# EAGLE schematic adafruit flora mainboard (EAGLE 6.5.0)
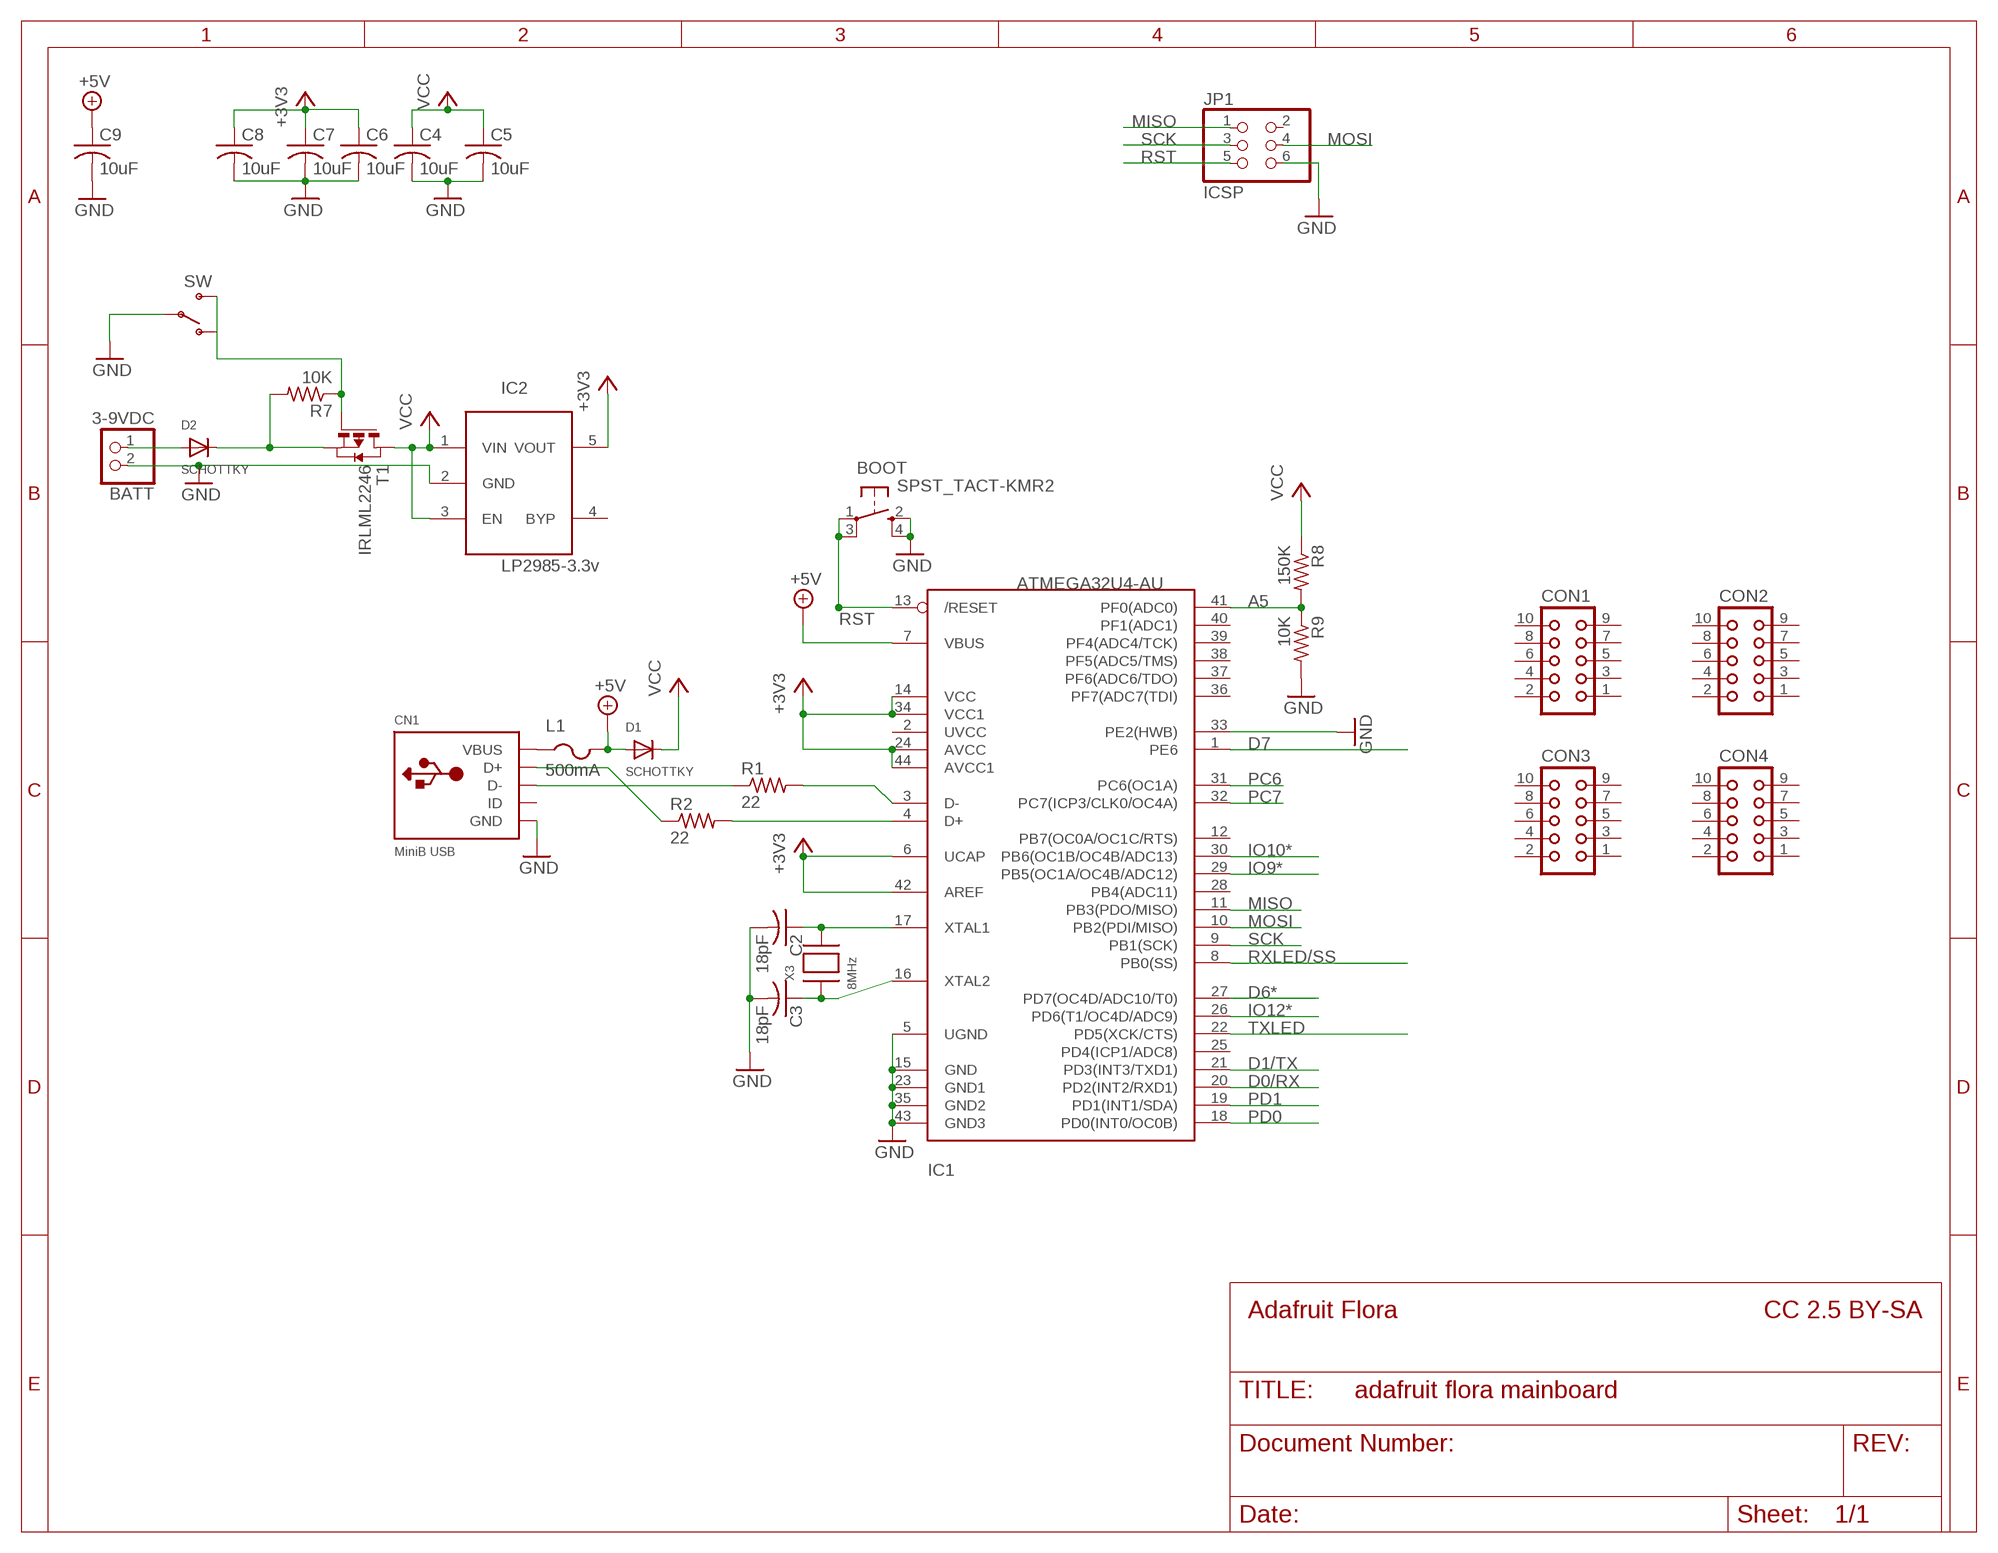
[diagram p0: schematic, sheet 1]

## Parts
BATT  3-9VDC  JST_2PIN-SMT-RA  [JST-PH-2-SMT-RA]
BOOT  SPST_TACT-KMR2  [KMR2]
C2  18pF  C-USC0805K  [C0805K]
C3  18pF  C-USC0805K  [C0805K]
C4  10uF  C-USC0805K  [C0805K]
C5  10uF  C-USC0805K  [C0805K]
C6  10uF  C-USC0805K  [C0805K]
C7  10uF  C-USC0805K  [C0805K]
C8  10uF  C-USC0805K  [C0805K]
C9  10uF  C-USC0805K  [C0805K]
CN1  MiniB USB  USBMINIBLARGE  [USB-MINIB_LARGER]
CON1  CON10  [CON10]
CON2  CON10  [CON10]
CON3  CON10  [CON10]
CON4  CON10  [CON10]
D1  SCHOTTKY  DIODESOD-123  [SOD-123]
D2  SCHOTTKY  DIODESOD-123  [SOD-123]
IC1  ATMEGA32U4-AU  [TQFP44]
IC2  LP2985-3.3v  LP298XS  [SOT23-5L]
JP1  ICSP  PINHD-2X3  [2X03]
L1  500mA  PTCFUSE-1206  [R1206]
R1  22  R-US_R0805  [R0805]
R2  22  R-US_R0805  [R0805]
R7  10K  R-US_R0805  [R0805]
R8  150K  R-US_R0805  [R0805]
R9  10K  R-US_R0805  [R0805]
SW  SPDT  SWITCH-SPSTSMD2  [SWITCH-SPDT-SMD]
T1  IRLML2246  PMOSSOT23  [SOT-23]
X3  8MHz  XTALNX5032  [NX5032]

## Nets
+3V3: C6.1 C7.1 C8.1 IC1.6(UCAP) IC1.14(VCC) IC1.24(AVCC) IC1.34(VCC1) IC1.42(AREF) IC1.44(AVCC1) IC2.5(VOUT)
+5V: C9.1 D1.A IC1.7(VBUS) L1.2
A5: IC1.41(PF0(ADC0)) R8.2 R9.1
D0/RX: IC1.20(PD2(INT2/RXD1))
D1/TX: IC1.21(PD3(INT3/TXD1))
D6*: IC1.27(PD7(OC4D/ADC10/T0))
D7: IC1.1(PE6)
GND: BATT.2 BOOT.2(S) BOOT.4(S1) C2.2 C3.2 C4.2 C5.2 C6.2 C7.2 C8.2 C9.2 CN1.GND IC1.5(UGND) IC1.15(GND) IC1.23(GND1) IC1.33(PE2(HWB)) IC1.35(GND2) IC1.43(GND3) IC2.2(GND) JP1.6 R9.2 SW.2(P)
IO9*: IC1.29(PB5(OC1A/OC4B/ADC12))
IO10*: IC1.30(PB6(OC1B/OC4B/ADC13))
IO12*: IC1.26(PD6(T1/OC4D/ADC9))
MISO: IC1.11(PB3(PDO/MISO)) JP1.1
MOSI: IC1.10(PB2(PDI/MISO)) JP1.4
N$2: CN1.D+ R2.1
N$3: IC1.3(D-) R1.2
N$4: IC1.4(D+) R2.2
N$5: CN1.D- R1.1
N$6: D2.C R7.2 T1.2(S)
N$7: BATT.1 D2.A
N$8: C2.1 IC1.17(XTAL1) X3.P$2
N$9: C3.1 IC1.16(XTAL2) X3.P$1
N$13: R7.1 SW.3(S) T1.3(G)
PC6: IC1.31(PC6(OC1A))
PC7: IC1.32(PC7(ICP3/CLK0/OC4A))
PD0: IC1.18(PD0(INT0/OC0B))
PD1: IC1.19(PD1(INT1/SDA))
RST: BOOT.1(P) BOOT.3(P1) IC1.13(/RESET) JP1.5
RXLED/SS: IC1.8(PB0(SS))
SCK: IC1.9(PB1(SCK)) JP1.3
TXLED: IC1.22(PD5(XCK/CTS))
VBUS: CN1.VBUS L1.1
VCC: C4.1 C5.1 D1.C IC2.1(VIN) IC2.3(EN) R8.1 T1.1(D)
Unconnected: CN1.ID CON1.1 CON1.2 CON1.3 CON1.4 CON1.5 CON1.6 CON1.7 CON1.8 CON1.9 CON1.10 CON2.1 CON2.2 CON2.3 CON2.4 CON2.5 CON2.6 CON2.7 CON2.8 CON2.9 CON2.10 CON3.1 CON3.2 CON3.3 CON3.4 CON3.5 CON3.6 CON3.7 CON3.8 CON3.9 CON3.10 CON4.1 CON4.2 CON4.3 CON4.4 CON4.5 CON4.6 CON4.7 CON4.8 CON4.9 CON4.10 IC1.2(UVCC) IC1.12(PB7(OC0A/OC1C/RTS)) IC1.25(PD4(ICP1/ADC8)) IC1.28(PB4(ADC11)) IC1.36(PF7(ADC7(TDI)) IC1.37(PF6(ADC6/TDO)) IC1.38(PF5(ADC5/TMS)) IC1.39(PF4(ADC4/TCK)) IC1.40(PF1(ADC1)) IC2.4(BYP) JP1.2 SW.1(O)

## Notes on the sheet
- Adafruit Flora | CC 2.5 BY-SA

## Library data of the parts
BATT = adafruit:JST_2PIN: JST 2-Pin Connectors of various flavors SMT-RA (S2B-PH-SM4) 4UConnector #17311 SMT (B2B-PH-SM4) THM-RA (S2B-PH) THM (B2B-PH)
BOOT = adafruit:SPST_TACT: SMT 6mm switch, EVQQ2 series http://www.ladyada.net/library/eagle
C2-C9 = adafruit:C-US: CAPACITOR, American symbol
CN1 = microbuilder:USB: USB Connectors USBMINIB - Surface Mount Female Mini-B USB Connector 4UConnector: 06564
CON1-CON4 = con-harting:CON10: CONNECTOR; OC_FARNELL: unknown; OC_NEWARK: unknown
D1 D2 = adafruit:DIODE: Diode SMADIODE - SMA Surface Mount Package 20V 1A Schottky Diode Digikey: 641-1014-6-ND DO-1N4148 - Through Hole Small Current Diode SOD-123 20V 1 A (.5mV Vf) Schottky Diode - Digikey: MBRX120TPMSCT-ND SOD-323 10V 570mA (.38mV Vf, 3ns) Schottky Diode - Digikey: ZLLS410CT-ND SOD-523 30V 30mA Schottky Diode (RB751S-40TE61) - Digikey: RB751S-40TE61CT-ND SOT23-R/W - SOT23 Package (R = Solder Paste/Reflow Ovens, W = Hand-Soldering) BAT54Film 40V 300mA - Digikey: 497-7162-1-ND
IC1 = adaprog:ATMEGA32U4
IC2 = adafruit:LP298X
JP1 = pinhead:PINHD-2X3: PIN HEADER
L1 = adafruit:PTCFUSE: PTC fuses, resettable thermistors
R1 R2 R7-R9 = adafruit:R-US_: RESISTOR, American symbol
SW = SparkFun:SWITCH-SPST: SPST Switch Simple slide switch. Spark Fun Electronics SKU : COM-00102
T1 = zetex:PMOSSOT23: MOS FET
X3 = adaprog:XTAL

## Net classes
0 default: width 0.254 mm, clearance 0.203 mm